# Altium project 信号层.PrjPcb
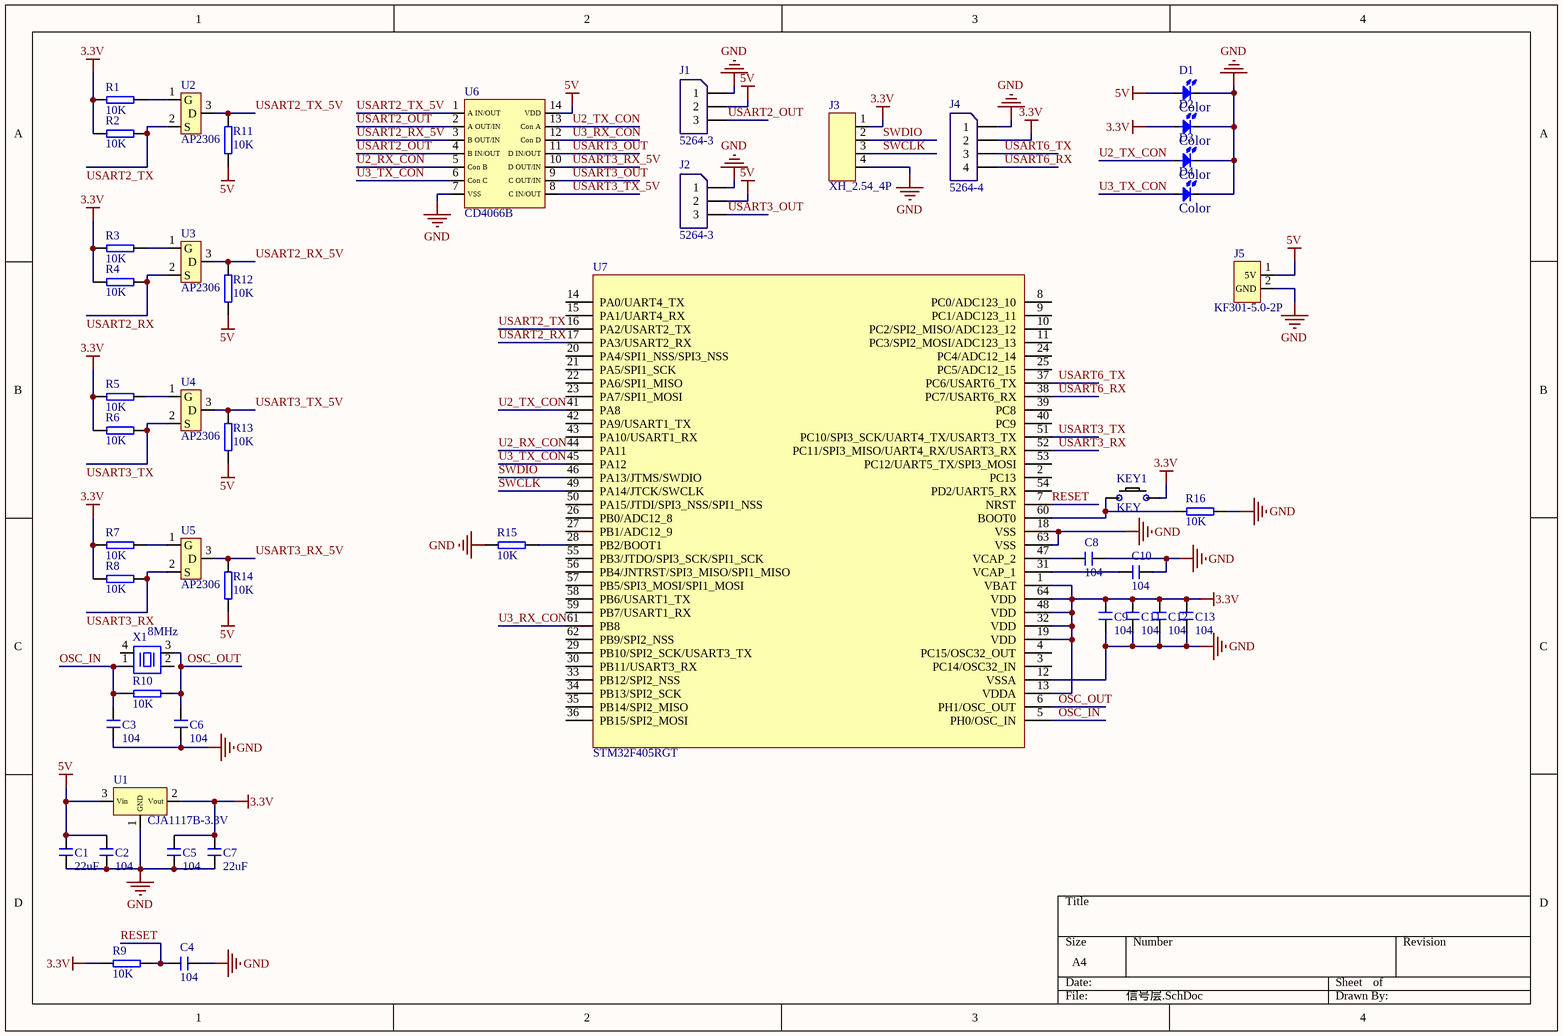
[diagram p0: 信号层.SchDoc]
1 sheet, 47 parts. Net scope: global (net labels, ports and power ports of the same name join across sheets).
Board file: 信号层.PcbDoc

## Sheet 信号层.SchDoc
size A4; SheetNumber: 1; SheetTotal: 1

### Parts
C1  22uF  [1206C]
C2  104  [0603C]
C3  104  [0603C]
C4  104  [0603C]
C5  104  [0603C]
C6  104  [0603C]
C7  22uF  [1206C]
C8  104  [0603C]
C9  104  [0603C]
C10  104  [0603C]
C11  104  [0603C]
C12  104  [0603C]
C13  104  [0603C]
D1  value Color  [0603Led]  (hidden comment: LED0603)
D2  value Color  [0603Led]  (hidden comment: LED0603)
D3  value Color  [0603Led]  (hidden comment: LED0603)
D4  value Color  [0603Led]  (hidden comment: LED0603)
J1  5264-3  [5264-3]
J2  5264-3  [5264-3]
J3  XH_2.54_4P  [XH-2.54_7P_2.54]
J4  5264-4  [5264-4]
J5  KF301-5.0-2P  [KF301-2P-DC]
KEY1  KEY  [KEY-SMD_2P-L6.0-W6.0-P6.00]
R1  10K  [0603R]
R2  10K  [0603R]
R3  10K  [0603R]
R4  10K  [0603R]
R5  10K  [0603R]
R6  10K  [0603R]
R7  10K  [0603R]
R8  10K  [0603R]
R9  10K  [0603R]
R10  10K  [0603R]
R11  10K  [0603R]
R12  10K  [0603R]
R13  10K  [0603R]
R14  10K  [0603R]
R15  10K  [0603R]
R16  10K  [0603R]
U1  CJA1117B-3.3V  [SOT-89-3_L4.5-W2.5-P1.50-LS4.2-BR]
U2  AP2306  [SOT-23-3_L2.9-W1.6-P1.90-LS2.8-BR]
U3  AP2306  [SOT-23-3_L2.9-W1.6-P1.90-LS2.8-BR]
U4  AP2306  [SOT-23-3_L2.9-W1.6-P1.90-LS2.8-BR]
U5  AP2306  [SOT-23-3_L2.9-W1.6-P1.90-LS2.8-BR]
U6  CD4066B  [TSSOP-14_L5.0-W4.4-P0.65-LS6.4-BL]
U7  STM32F405RGT  [LQFP64]
X1  8MHz  [CRYSTAL-SMD_4P-L5.0-W3.2-BL]

### Nets
3.3V: C5.2 C7.2 C9.2 C11.2 C12.2 C13.2 D2.2 J3.1 J4.2 KEY1.2 R1.1 R2.1 R3.1 R4.1 R5.1 R6.1 R7.1 R8.1 R9.1 U1.2(Vout) U7.1(VBAT) U7.13(VDDA) U7.19(VDD) U7.32(VDD) U7.48(VDD) U7.64(VDD)
5V: C1.2 C2.2 D1.2 J1.2 J2.2 J5.1(5V) R11.1 R12.1 R13.1 R14.1 U1.3(Vin) U6.14(VDD)
GND: C1.1 C2.1 C3.1 C4.2 C5.1 C6.1 C7.1 C8.2 C9.1 C10.2 C11.1 C12.1 C13.1 D1.1 D2.1 D3.1 D4.1 J1.1 J2.1 J3.4 J4.1 J5.2(GND) R15.1 R16.1 U1.1(GND) U6.7(VSS) U7.12(VSSA) U7.18(VSS) U7.63(VSS)
OSC_IN: C3.2 R10.1 U7.5(PH0/OSC_IN) X1.1
OSC_OUT: C6.2 R10.2 U7.6(PH1/OSC_OUT) X1.3
RESET: C4.1 R9.2 U7.7(NRST)
SWCLK: J3.3 U7.49(PA14/JTCK/SWCLK)
SWDIO: J3.2 U7.46(PA13/JTMS/SWDIO)
U2_RX_CON: U6.5(Con_B) U7.44(PA11)
U2_TX_CON: D3.2 U6.13(Con_A) U7.41(PA8)
U3_RX_CON: U6.12(Con_D) U7.61(PB8)
U3_TX_CON: D4.2 U6.6(Con_C) U7.45(PA12)
USART2_OUT: J1.3 U6.2(A_OUT/IN) U6.4(B_IN/OUT)
USART2_RX: R4.2 U3.2(S) U7.17(PA3/USART2_RX)
USART2_RX_5V: R12.2 U3.3(D) U6.3(B_OUT/IN)
USART2_TX: R2.2 U2.2(S) U7.16(PA2/USART2_TX)
USART2_TX_5V: R11.2 U2.3(D) U6.1(A_IN/OUT)
USART3_OUT: J2.3 U6.9(C_OUT/IN) U6.11(D_IN/OUT)
USART3_RX: R8.2 U5.2(S) U7.52(PC11/SPI3_MISO/UART4_RX/USART3_RX)
USART3_RX_5V: R14.2 U5.3(D) U6.10(D_OUT/IN)
USART3_TX: R6.2 U4.2(S) U7.51(PC10/SPI3_SCK/UART4_TX/USART3_TX)
USART3_TX_5V: R13.2 U4.3(D) U6.8(C_IN/OUT)
USART6_RX: J4.4 U7.38(PC7/USART6_RX)
USART6_TX: J4.3 U7.37(PC6/USART6_TX)
NetC8_1: C8.1 U7.47(VCAP_2)
NetC10_1: C10.1 U7.31(VCAP_1)
NetKEY1_1: KEY1.1 R16.2 U7.60(BOOT0)
NetR1_2: R1.2 U2.1(G)
NetR3_2: R3.2 U3.1(G)
NetR5_2: R5.2 U4.1(G)
NetR7_2: R7.2 U5.1(G)
NetR15_2: R15.2 U7.28(PB2/BOOT1)

Not connected (* = marked no-connect by the designer): U7 2(PC13) 3(PC14/OSC32_IN) 4(PC15/OSC32_OUT) 8(PC0/ADC123_10) 9(PC1/ADC123_11) 10(PC2/SPI2_MISO/ADC123_12) 11(PC3/SPI2_MOSI/ADC123_13) 14(PA0/UART4_TX) 15(PA1/UART4_RX) 20(PA4/SPI1_NSS/SPI3_NSS) 21(PA5/SPI1_SCK) 22(PA6/SPI1_MISO) 23(PA7/SPI1_MOSI) 24(PC4/ADC12_14) 25(PC5/ADC12_15) 26(PB0/ADC12_8) 27(PB1/ADC12_9) 29(PB10/SPI2_SCK/USART3_TX) 30(PB11/USART3_RX) 33(PB12/SPI2_NSS) 34(PB13/SPI2_SCK) 35(PB14/SPI2_MISO) 36(PB15/SPI2_MOSI) 39(PC8) 40(PC9) 42(PA9/USART1_TX) 43(PA10/USART1_RX) 50(PA15/JTDI/SPI3_NSS/SPI1_NSS) 53(PC12/UART5_TX/SPI3_MOSI) 54(PD2/UART5_RX) 55(PB3/JTDO/SPI3_SCK/SPI1_SCK) 56(PB4/JNTRST/SPI3_MISO/SPI1_MISO) 57(PB5/SPI3_MOSI/SPI1_MOSI) 58(PB6/USART1_TX) 59(PB7/USART1_RX) 62(PB9/SPI2_NSS); X1 2 4

### Library data of the parts
C1 C7 = CAP_1206
C2-C6 C8-C13 = CAP_0603
J1 J2 = 5264-3: 电机连接线
J3 = XH_2.54_4P: 端子
J4 = 5264-4: 串口线
J5 = KF301-5.0-2P: 电源输入
R1-R16 = RES
U1 = CJA1117B-3.3V: STM32电源输入
U2-U5 = AP2306: NMOS
U6 = CD4066B: 双向传输门（FET开关）
X1 = X1H008000DK1H-X: 无源晶体